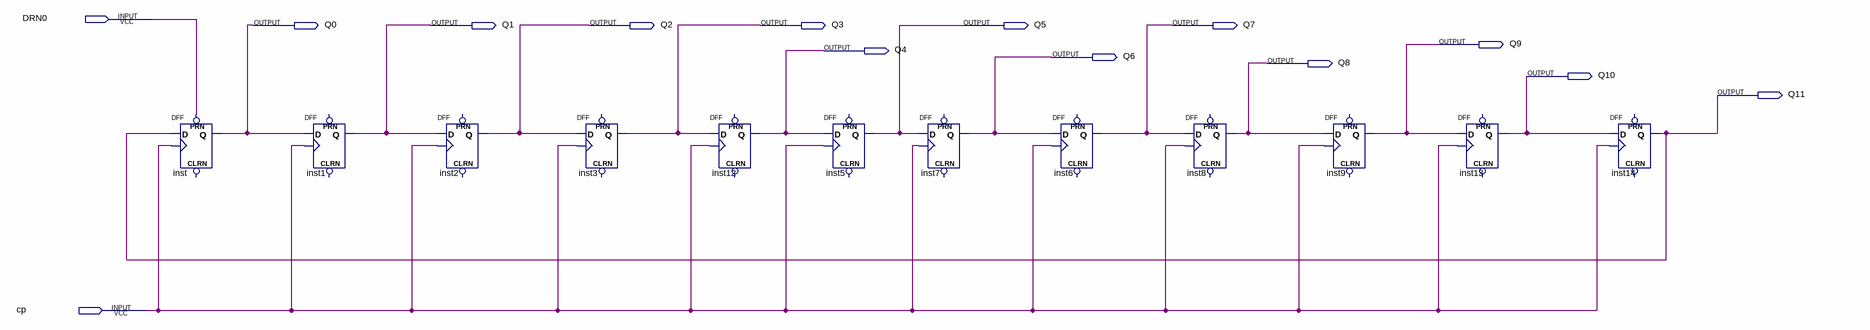
[diagram p0: schematic sheet]
// Quartus schematic moc.bdf as structural Verilog: 12 symbols, 14 pins
module moc (
  input  DRN0,
  input  cp,
  output Q0,
  output Q1,
  output Q2,
  output Q3,
  output Q5,
  output Q7,
  output Q9,
  output Q4,
  output Q6,
  output Q8,
  output Q10,
  output Q11
);

  DFF inst (.CLK(cp), .D(Q11), .PRN(DRN0), .Q(Q0));  // open: CLRN
  DFF inst1 (.CLK(cp), .D(Q0), .Q(Q1));  // open: CLRN, PRN
  DFF inst2 (.CLK(cp), .D(Q1), .Q(Q2));  // open: CLRN, PRN
  DFF inst3 (.CLK(cp), .D(Q2), .Q(Q3));  // open: CLRN, PRN
  DFF inst12 (.CLK(cp), .D(Q3), .Q(Q4));  // open: CLRN, PRN
  DFF inst5 (.CLK(cp), .D(Q4), .Q(Q5));  // open: CLRN, PRN
  DFF inst7 (.CLK(cp), .D(Q5), .Q(Q6));  // open: CLRN, PRN
  DFF inst6 (.CLK(cp), .D(Q6), .Q(Q7));  // open: CLRN, PRN
  DFF inst8 (.CLK(cp), .D(Q7), .Q(Q8));  // open: CLRN, PRN
  DFF inst9 (.CLK(cp), .D(Q8), .Q(Q9));  // open: CLRN, PRN
  DFF inst13 (.CLK(cp), .D(Q9), .Q(Q10));  // open: CLRN, PRN
  DFF inst14 (.CLK(cp), .D(Q10), .Q(Q11));  // open: CLRN, PRN
endmodule
